# EAGLE design UTAP2022_SENSOR_v1.1 (EAGLE 7.5.0)
ABBREV: hb1; PROJECT: Heading Board
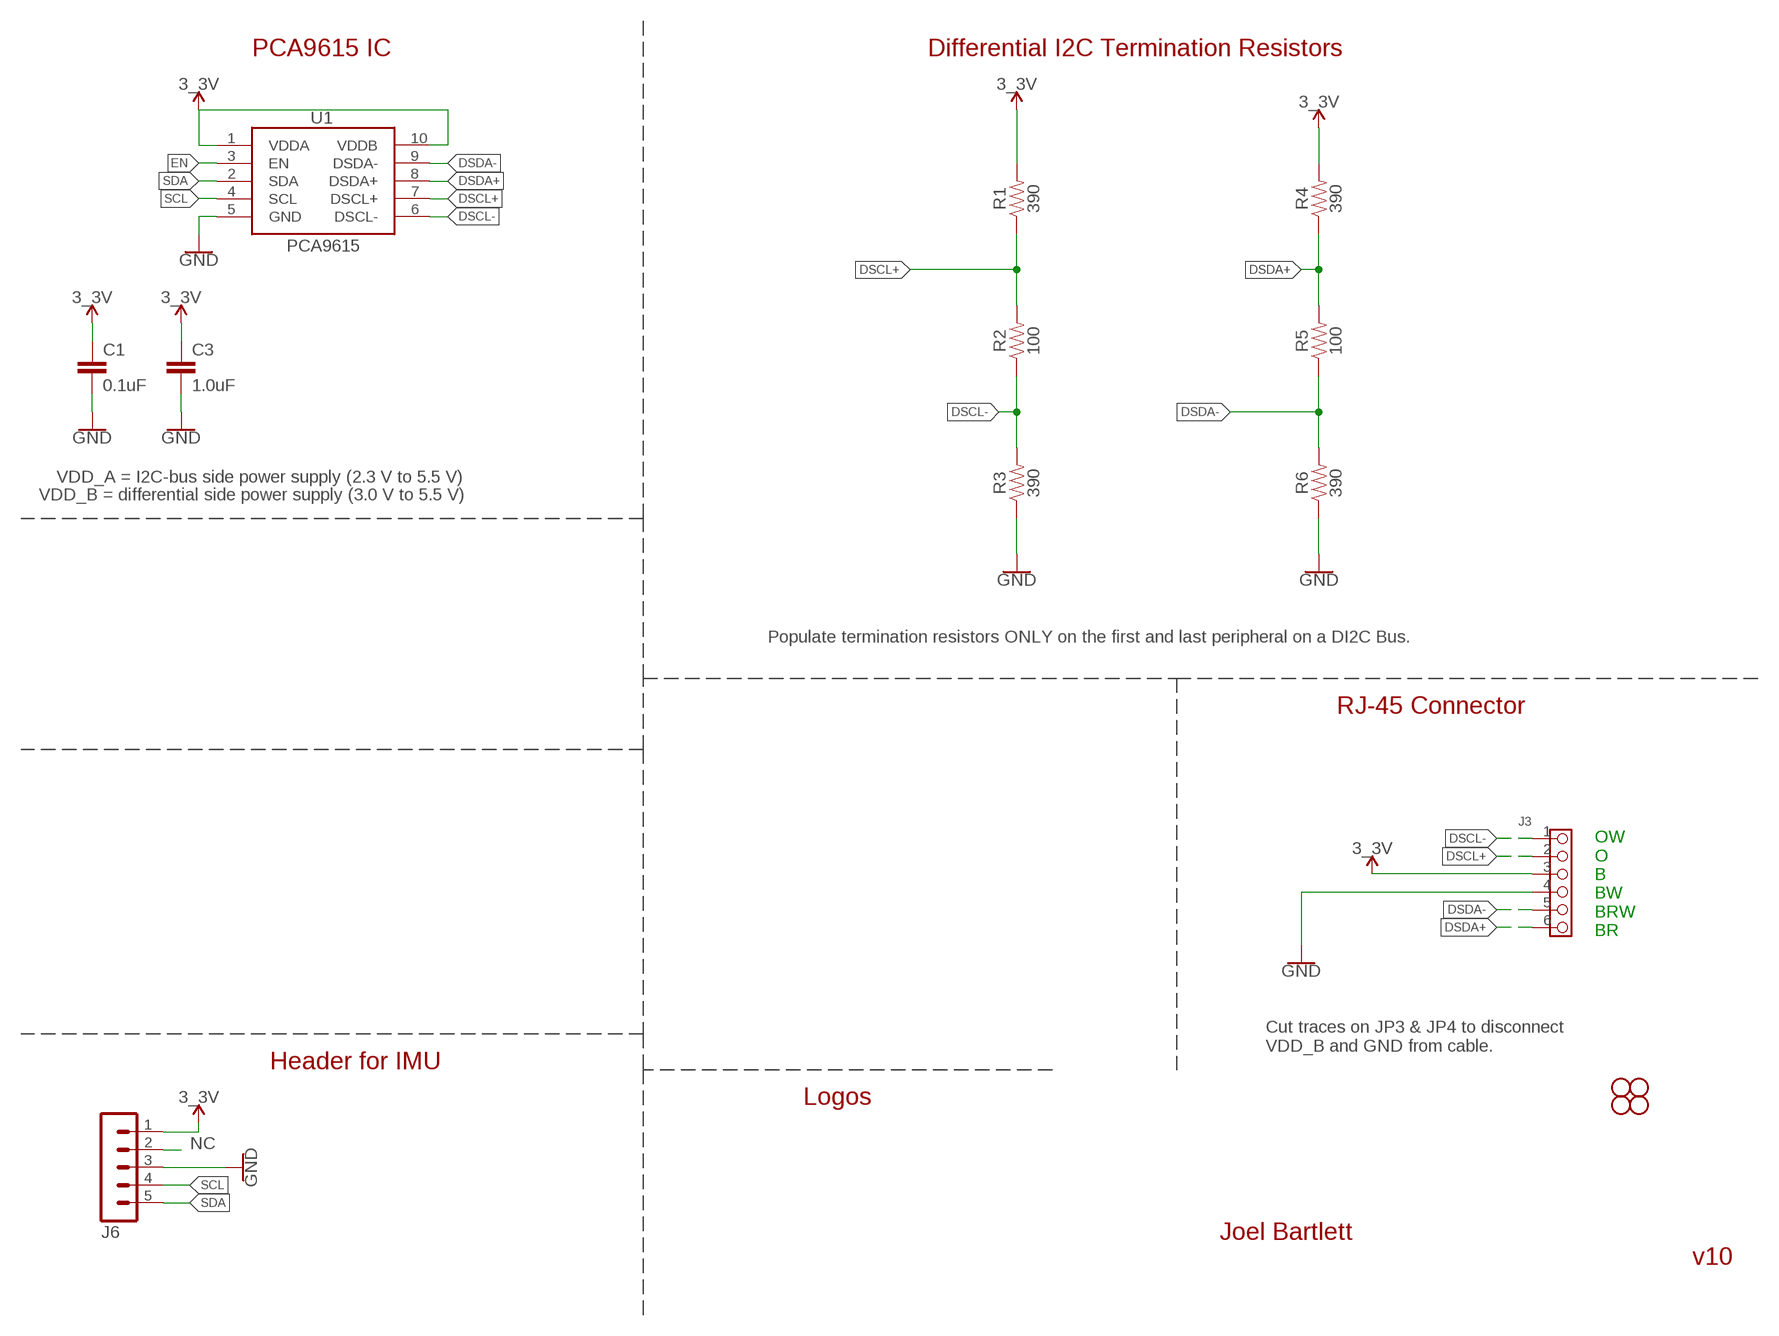
[diagram p0: schematic, sheet 1]

## Parts
C1  0.1uF  0.1UF-0603-25V-(+80/-20%)  [0603]
C3  1.0uF  1.0UF-0603-16V-10%  [0603]
H1  STAND-OFF  [STAND-OFF]
H2  STAND-OFF  [STAND-OFF]
H3  STAND-OFF  [STAND-OFF]
H4  STAND-OFF  [STAND-OFF]
J3  CONNECTOR_HEADER-6P-55/35MIL  [CONNECTOR_6P-2.54-55/35MIL]
J6  MA05-1  [MA05-1]
R1  390  390OHM-0603-1/10W-1%  [0603]
R2  100  100OHM-0603-1/10W-1%  [0603]
R3  390  390OHM-0603-1/10W-1%  [0603]
R4  390  390OHM-0603-1/10W-1%  [0603]
R5  100  100OHM-0603-1/10W-1%  [0603]
R6  390  390OHM-0603-1/10W-1%  [0603]
U1  PCA9615  [TSSOP10]

## Nets
DSCL+: J3.2 R1.1 R2.2 U1.7(DSCL+)
DSCL-: J3.1 R2.1 R3.2 U1.6(DSCL-)
DSDA+: J3.6 R4.1 R5.2 U1.8(DSDA+)
DSDA-: J3.5 R5.1 R6.2 U1.9(DSDA-)
EN: U1.3(EN)
GND: C1.2 C3.2 J3.4 J6.3 R3.1 R6.1 U1.5(GND)
NC: J6.2
SCL: J6.4 U1.4(SCL)
SDA: J6.5 U1.2(SDA)
VDD_A: C1.1 C3.1 J3.3 J6.1 R1.2 R4.2 U1.1(VDDA) U1.10(VDDB) ; supply symbol labelled 3_3V

## Notes on the sheet
- PCA9615 IC | Differential I2C Termination Resistors
- VDD_A = I2C-bus side power supply (2.3 V to 5.5 V)
- VDD_B = differential side power supply (3.0 V to 5.5 V)
- Populate termination resistors ONLY on the first and last peripheral on a DI2C Bus.
- RJ-45 Connector
- OW
  O
  B
  BW
  BRW
  BR
- Cut traces on JP3 & JP4 to disconnect 
  VDD_B and GND from cable.
- Header for IMU
- Logos
- Joel Bartlett
- v10

## Library data of the parts
C1 = SparkFun-Capacitors:0.1UF: 0.1µF ceramic capacitors A capacitor is a passive two-terminal electrical component used to store electrical energy temporarily in an electric field.; PROD_ID: CAP-00810
C3 = SparkFun-Capacitors:1.0UF: 1µF ceramic capacitors A capacitor is a passive two-terminal electrical component used to store electrical energy temporarily in an electric field.; PROD_ID: CAP-00868
H1-H4 = SparkFun-Hardware:STAND-OFF: Stand Off Drill holes for mechanically mounting via screws, standoffs, etc. Note: Use the keepout ring to avoid running the screw head into surrounding components. Variant Overviews STAND-OFF - Mechanical footprint for a #4 phillips button head screw. STAND-OFF-TIGHT - Mechanical footprint for a #4 phillips button head screw, Example SparkFun Products Screw - Phillips Head (1/4", 4-40, 10 pack) <https://www.sparkfun.com/products/10453> (PRT-10453) Screw - Phillips Head (1/2", 4-40, 10 pack) <https://www.sparkfun.com/products/10452> (PRT-10452) Screw - Phillips Head (3/4", 4-40, 10 pack) <https://www.sparkfun.com/products/10451> (PRT-10451) Screw - Phillips Head (1", 4-40, 10 pack) <https://www.sparkfun.com/products/10450> (PRT-10450)
J3 = Seeeduino_Mega:CONNECTOR_HEADER-6P
J6 = con-lstb:MA05-1: PIN HEADER; OC_FARNELL: unknown; OC_NEWARK: unknown
R1 R3 R4 R6 = SparkFun-Resistors:390OHM: 390Ω resistor A resistor is a passive two-terminal electrical component that implements electrical resistance as a circuit element. Resistors act to reduce current flow, and, at the same time, act to lower voltage levels within circuits. - Wikipedia; PROD_ID: RES-07864
R2 R5 = SparkFun-Resistors:100OHM: 100Ω resistor A resistor is a passive two-terminal electrical component that implements electrical resistance as a circuit element. Resistors act to reduce current flow, and, at the same time, act to lower voltage levels within circuits. - Wikipedia; PROD_ID: RES-07863
U1 = SparkFun-IC-Comms:PCA9615: Differential I2C Bus Buffer Datasheet <https://www.nxp.com/docs/en/data-sheet/PCA9615.pdf>; PROD_ID: IC-13899

## Net classes
0 default: width 0.203 mm
1 power: width 0.381 mm, clearance 0.254 mm

## Board
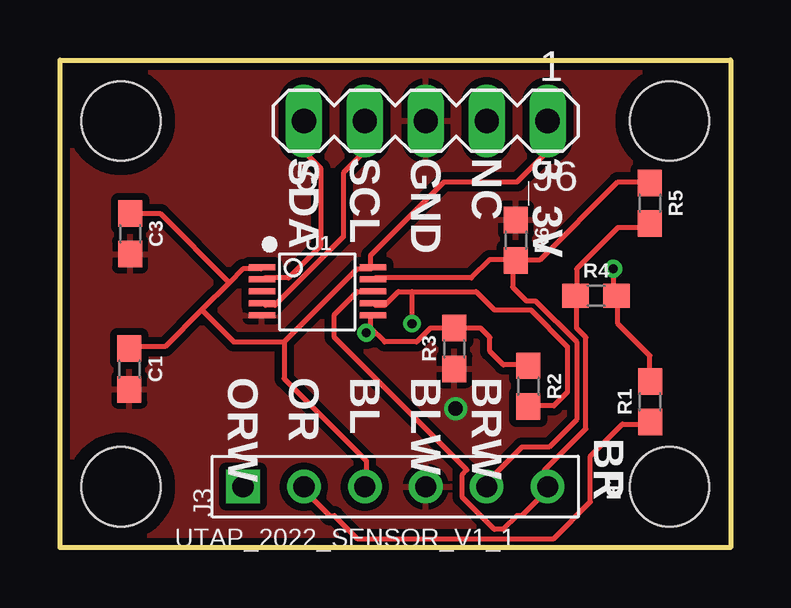
[diagram p1: board, top side]
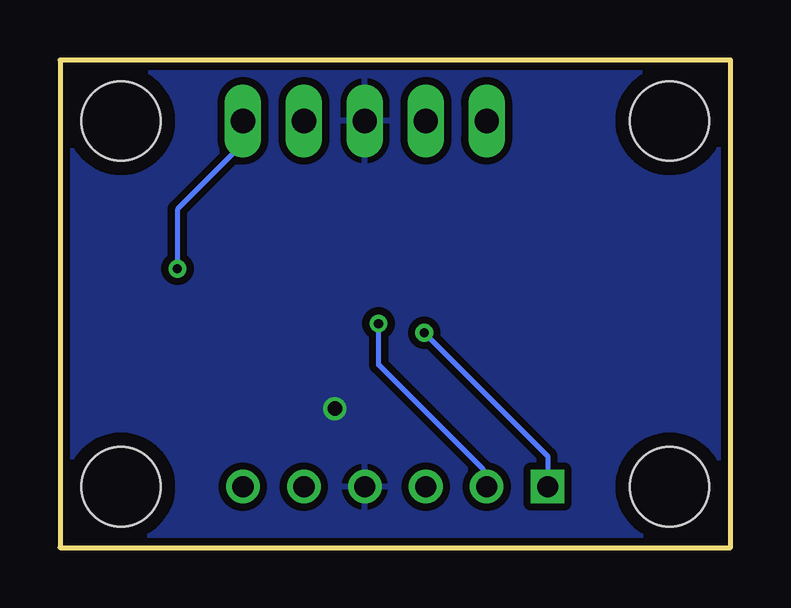
[diagram p2: board, bottom side, seen from below]

Size 27.94 x 20.32 mm. Coordinates in mm from the lower left corner, seen from the top.
Outline: 0,0 0,20.32 27.94,20.32 27.94,0 0,0
Copper layers (1*16): Top 0.035mm / dielectric 1.5mm / Bottom 0.035mm
Design rules "SparkFun-2-layer-TIGHT": minimum track width 7mil, minimum drill 15mil, track to track 7mil, track to pad 7mil, pad to pad 7mil, via to via 7mil, smd to smd 7mil, copper to edge 7mil, drill to drill 7mil, minimum pad ring 7mil, minimum via ring 7mil, stop-mask expansion 4mil, vias tented up to drill 25mil, thermal gap 10mil

### Footprints (pad centres in the part's own frame; a part is rotated, then mirrored left to right if it is on the bottom)
0603 = smd 1.1 x 1: 1 -0.85,0; 2 0.85,0
STAND-OFF = hole 3.302: 0,0
CONNECTOR_6P-2.54-55/35MIL = drill 0.889 pad 1.397 square: 1 0,6.35 | drill 0.889 pad 1.397: 2 0,3.81; 3 0,1.27; 4 0,-1.27; 5 0,-3.81; 6 0,-6.35
MA05-1 = drill 1.016 long: 1 -5.08,0; 2 -2.54,0; 3 0,0; 4 2.54,0; 5 5.08,0
TSSOP10 = smd 1.1 x 0.25: 1 -2.259,1.018; 2 -2.259,0.517; 3 -2.259,0.018; 4 -2.259,-0.482; 5 -2.259,-0.988; 6 2.366,-0.988; 7 2.366,-0.482; 8 2.366,0.018; 9 2.366,0.517; 10 2.366,1.018

### Placement (x,y rotation side)
C1  2.9,7.44 270 top
C3  2.92,13.08 270 top
H1  25.4,2.54 90 top
H2  25.4,17.78 90 top
H3  2.54,2.54 90 top
H4  2.54,17.78 90 top
J3  13.97,2.54 90 top
J6  15.24,17.78 180 top
R1  24.59,6.08 90 top
R2  19.52,6.73 270 top
R3  16.43,8.3 90 top
R4  22.34,10.49 0 top
R5  24.58,14.35 270 top
R6  19,12.81 270 top
U1  10.67,10.67 0 top

### Tracks (layer width: path | path; a pad name or v marks a point on that pad's centre or on a via)
DSCL+  (via drill 0.38)
  Top 0.203: 14.67,10.67 14.1,10.67 13.53,10.1 13.14,10.1 U1.7 | 14.67,10.67 17.34,10.67 18.1,9.91 19.62,9.91 21.14,8.38 21.14,6.48 20.57,5.91 19.62,5.91 R2.2 | R1.1 24.57,5.14 23.43,5.14 22.1,3.81 22.1,1.91 20.57,0.38 12.38,0.38 11.43,1.33 11.24,1.33 10.1,2.48 J3.2 | v14.67,9.34 14.67,10.67
  Bottom 0.203: v14.67,9.34 14.67,7.62 10.29,3.24 10.29,2.67 J3.2
DSCL-  (via drill 0.38)
  Top 0.203: R2.1 19.43,7.62 18.48,7.62 17.91,8.19 17.91,8.76 17.53,9.14 16.57,9.14 R3.2 16.38,9.14 15.43,9.14 14.86,8.57 13.53,8.57 12.95,9.14 | 12.95,9.14 12.95,9.72 U1.6 | 12.95,9.14 v12.76,8.95
  Bottom 0.203: J3.1 7.62,3.81 v12.76,8.95
DSDA+
  Top 0.203: R5.2 24.57,13.34 23.24,13.34 21.53,11.62 21.53,10.67 R4.1 21.53,10.48 21.53,9.14 21.91,8.76 21.91,4.95 20.19,3.24 20.19,2.67 J3.6 20.38,2.48 19.24,1.33 19.05,1.33 18.48,0.76 18.1,0.76 16.76,2.1 16.76,3.05 16.95,3.24 11.43,8.76 11.43,9.72 12.38,10.67 12.95,10.67 U1.8
DSDA-
  Top 0.203: U1.9 13.14,11.24 17.14,11.24 17.91,12 18.86,12 R6.2 | R5.1 24.57,15.24 23.24,15.24 20,12 19.05,12 R6.2 | J3.5 17.91,2.67 17.91,2.86 19.24,4.19 20.38,4.19 21.53,5.33 21.53,8.57 19.81,10.29 19.43,10.29 18.86,10.86 18.86,11.81 R6.2
GND  (via drill 0.6 pad 0.13)
  Top 0.203: R3.1 16.38,7.43 16.31,7.43
  other vias: 16.48,5.79
  pour Top (isolate 0.305): 27.94,0 0,0 0,20.32 27.94,20.32
  pour Bottom (isolate 0.305): 27.94,0 0,0 0,20.32 27.94,20.32
SCL
  Top 0.203: U1.4 8.57,10.1 8.95,10.1 11.81,12.95 11.81,15.62 12.57,16.38 12.57,17.72 J6.4
SDA
  Top 0.203: U1.2 8.57,11.24 9.53,11.24 10.86,12.57 10.86,15.81 10.29,16.38 10.29,17.72 J6.5
VDD_A  (via drill 0.38)
  Top 0.203: R1.2 24.57,7.05 24.57,8 23.24,9.34 23.24,10.48 R4.2 23.05,10.67 v23.05,11.62 | 7.05,11.05 7.62,11.62 8.38,11.62 U1.1 | 7.05,11.05 5.91,9.91 | 5.91,9.91 4.38,8.38 3.05,8.38 C1.1 | 7.05,11.05 4.19,13.91 3.05,13.91 C3.1 | 12.95,11.62 12.38,11.62 9.34,8.57 | 9.34,8.57 7.24,8.57 5.91,9.91 | 9.34,8.57 9.34,7.05 12.76,3.62 12.76,2.67 J3.3 | 12.95,11.62 12.95,12.19 16,15.24 19.05,15.24 20.19,16.38 20.19,17.72 J6.1 | 12.95,11.62 U1.10
  Bottom 0.203: v23.05,11.62 23.05,14.1 20.38,16.76 20.38,17.72 J6.1

### Text on the board
tPlace: SDA | SCL | GND | NC | 3_3V | ORW | OR | BL | BLW | BRW | BR
tNames: UTAP_2022_SENSOR_V1_1
Measures: Measurements in mm